# EAGLE design Master (EAGLE 9.1.3)
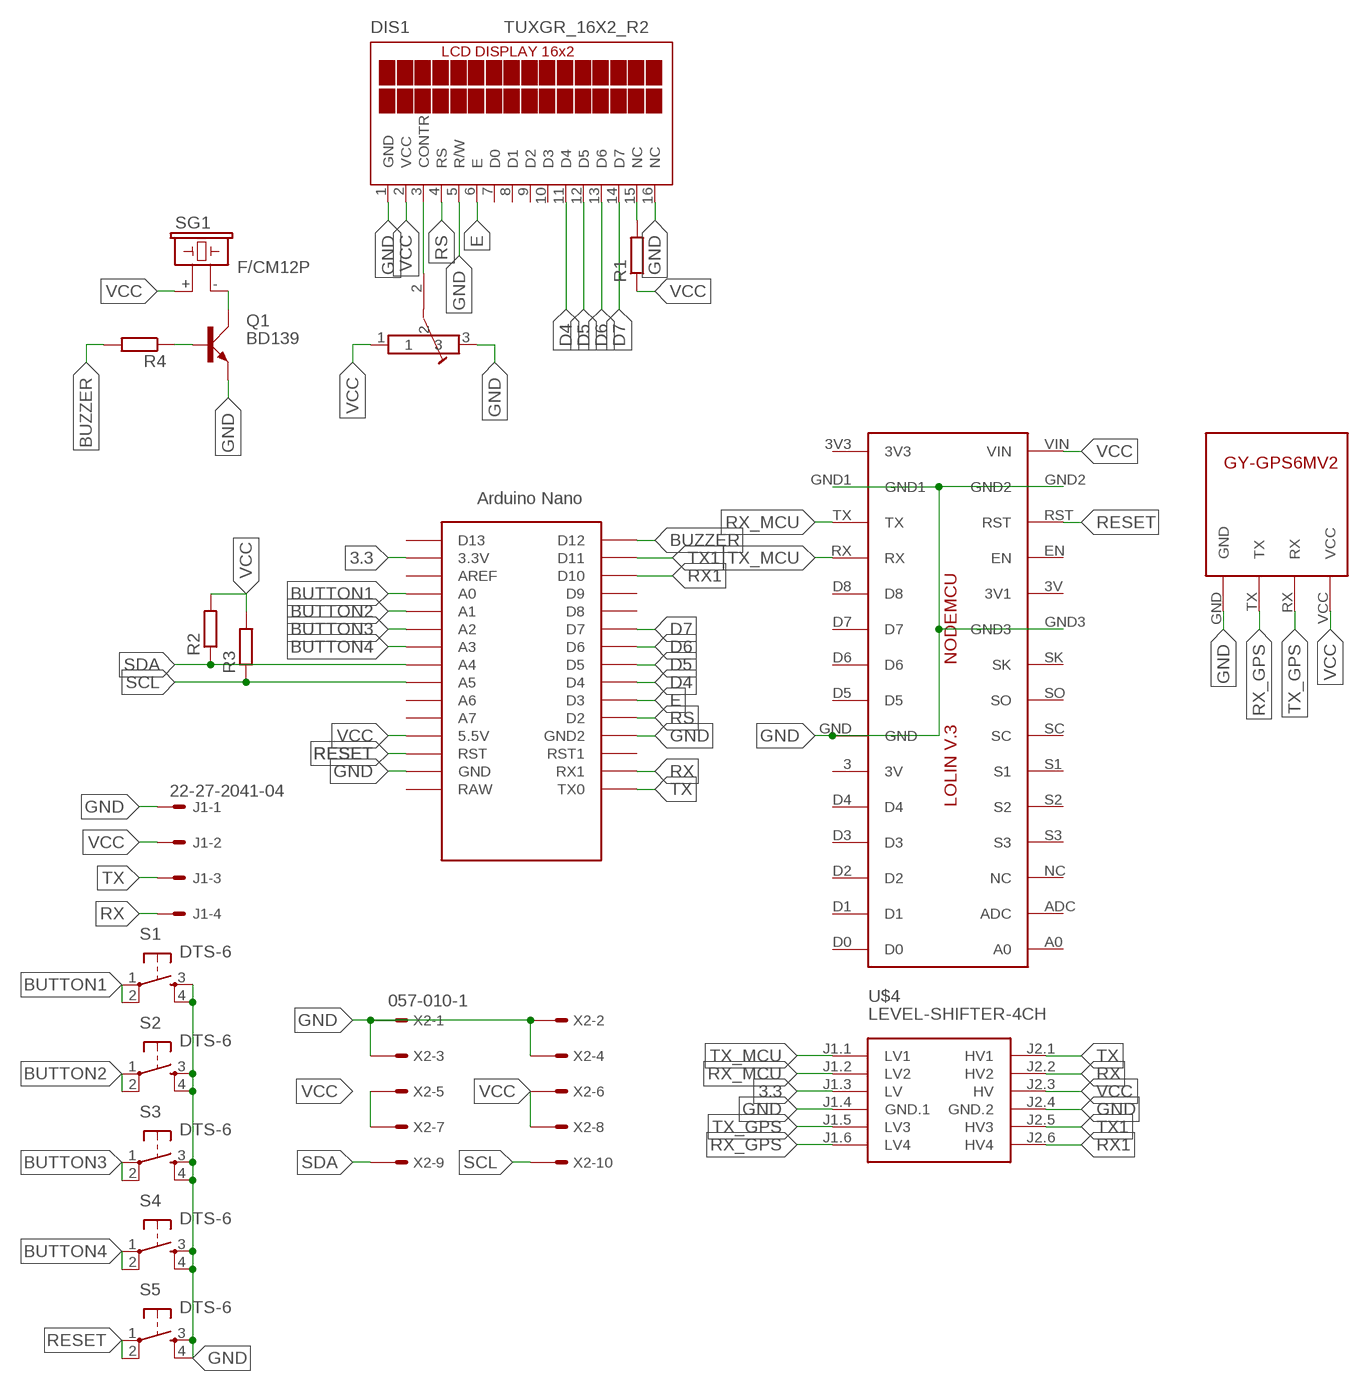
[diagram p0: schematic, sheet 1]

## Parts
DIS1  TUXGR_16X2_R2  [TUXGR_16X2_R2]
IC1  LOLINV3  [LOLINV3]
J1  22-27-2041-04  [6410-04]
Q1  BD139  [TO126AV]
R1  R-EU_M0805  [M0805]
R2  R-EU_M0805  [M0805]
R3  R-EU_M0805  [M0805]
R4  R-EU_M0805  [M0805]
S1  DTS-6  [DTS-6]
S2  DTS-6  [DTS-6]
S3  DTS-6  [DTS-6]
S4  DTS-6  [DTS-6]
S5  DTS-6  [DTS-6]
SG1  F/CM12P  [F/CM12P]
U$1  NANO  [NANO]
U$2  TRIMPOT  [TRIMPOT]
U$4  LEVEL-SHIFTER-4CH  [LEVEL-SHIFTER-4CH]
U$5  GY-GPS6MV2  [GY-GPS6MV2]
X2  057-010-1  [057-010-1]

## Nets
3.3: U$1.3.3V U$4.J1.3(LV)
BUTTON1: S1.1 S1.2 U$1.A0
BUTTON2: S2.1 S2.2 U$1.A1
BUTTON3: S3.1 S3.2 U$1.A2
BUTTON4: S4.1 S4.2 U$1.A3
BUZZER: R4.2 U$1.D12
D4: DIS1.11(D4) U$1.D4
D5: DIS1.12(D5) U$1.D5
D6: DIS1.13(D6) U$1.D6
D7: DIS1.14(D7) U$1.D7
E: DIS1.6(E) U$1.D3
GND: DIS1.1(GND) DIS1.5(R/W) DIS1.16(NC) IC1.GND IC1.GND1 IC1.GND2 IC1.GND3 J1.1 Q1.E S1.3 S1.4 S2.3 S2.4 S3.3 S3.4 S4.3 S4.4 S5.3 S5.4 U$1.GND U$1.GND1(GND2) U$2.3 U$4.J1.4(GND.1) U$4.J2.4(GND.2) U$5.GND X2.1 X2.2 X2.3 X2.4
N$1: DIS1.3(CONTR) U$2.2
N$2: DIS1.15(NC) R1.2
N$3: Q1.B R4.1
N$4: Q1.C SG1.-
RESET: IC1.RST S5.1 S5.2 U$1.RST
RS: DIS1.4(RS) U$1.D2
RX: J1.4 U$1.RX1 U$4.J2.2(HV2)
RX1: U$1.D10 U$4.J2.6(HV4)
RX_GPS: U$4.J1.6(LV4) U$5.TX
RX_MCU: IC1.TX U$4.J1.2(LV2)
SCL: R3.1 U$1.A5 X2.10
SDA: R2.1 U$1.A4 X2.9
TX: J1.3 U$1.TX0 U$4.J2.1(HV1)
TX1: U$1.D11 U$4.J2.5(HV3)
TX_GPS: U$4.J1.5(LV3) U$5.RX
TX_MCU: IC1.RX U$4.J1.1(LV1)
VCC: DIS1.2(VCC) IC1.VIN J1.2 R1.1 R2.2 R3.2 SG1.+ U$1.5V(5.5V) U$2.1 U$4.J2.3(HV) U$5.VCC X2.5 X2.6 X2.7 X2.8
Unconnected: DIS1.7(D0) DIS1.8(D1) DIS1.9(D2) DIS1.10(D3) IC1.3(3V) IC1.3V3 IC1.3V(3V1) IC1.A0 IC1.ADC IC1.D0 IC1.D1 IC1.D2 IC1.D3 IC1.D4 IC1.D5 IC1.D6 IC1.D7 IC1.D8 IC1.EN IC1.NC IC1.S1 IC1.S2 IC1.S3 IC1.SC IC1.SK IC1.SO U$1.A6 U$1.A7 U$1.AREF U$1.D8 U$1.D9 U$1.D13 U$1.RAW U$1.RST1

## Library data of the parts
DIS1 = display-lcd:TUXGR_16X2_R2: Tuxgraphics LCD display 16x2 characters reflective, without background light Source: tuxgr_12x2_r2.pdf; OC_FARNELL: unknown; OC_NEWARK: unknown
IC1 = NodeMCU Extra Memory:LOLINV3
J1 = con-molex:22-?-04: CONNECTOR wire to board 2.54 mm (.1 inch) pitch header; MF: MOLEX; OC_FARNELL: unknown; OC_NEWARK: unknown
Q1 = transistor-power:BD139: NPN TRANSISTOR
R1-R4 = rcl:R-EU_: RESISTOR, European symbol; SPICEPREFIX: R
S1-S5 = switch-tact:DTS-6
SG1 = buzzer:F/CM12P: BUZZER Source: Buerklin; OC_FARNELL: unknown; OC_NEWARK: unknown
U$1 = Arduino-clone:NANO: Arduino Nano
U$2 = trimpot:TRIMPOT
U$4 = GPS neo6mv2:LEVEL-SHIFTER-4CH: 4-Channel Bi-Directional Logic Level Converter based on BSS128 transistors Click here to find device on ebay.com <http://www.ebay.com/sch/i2c+logic+converter+module>
U$5 = GY-GPS6MV2:GY-GPS6MV2
X2 = con-panduit:057-010-: CONNECTOR 10-pin series 057 contact pc board low profile headers; OC_FARNELL: unknown; OC_NEWARK: unknown

## Board
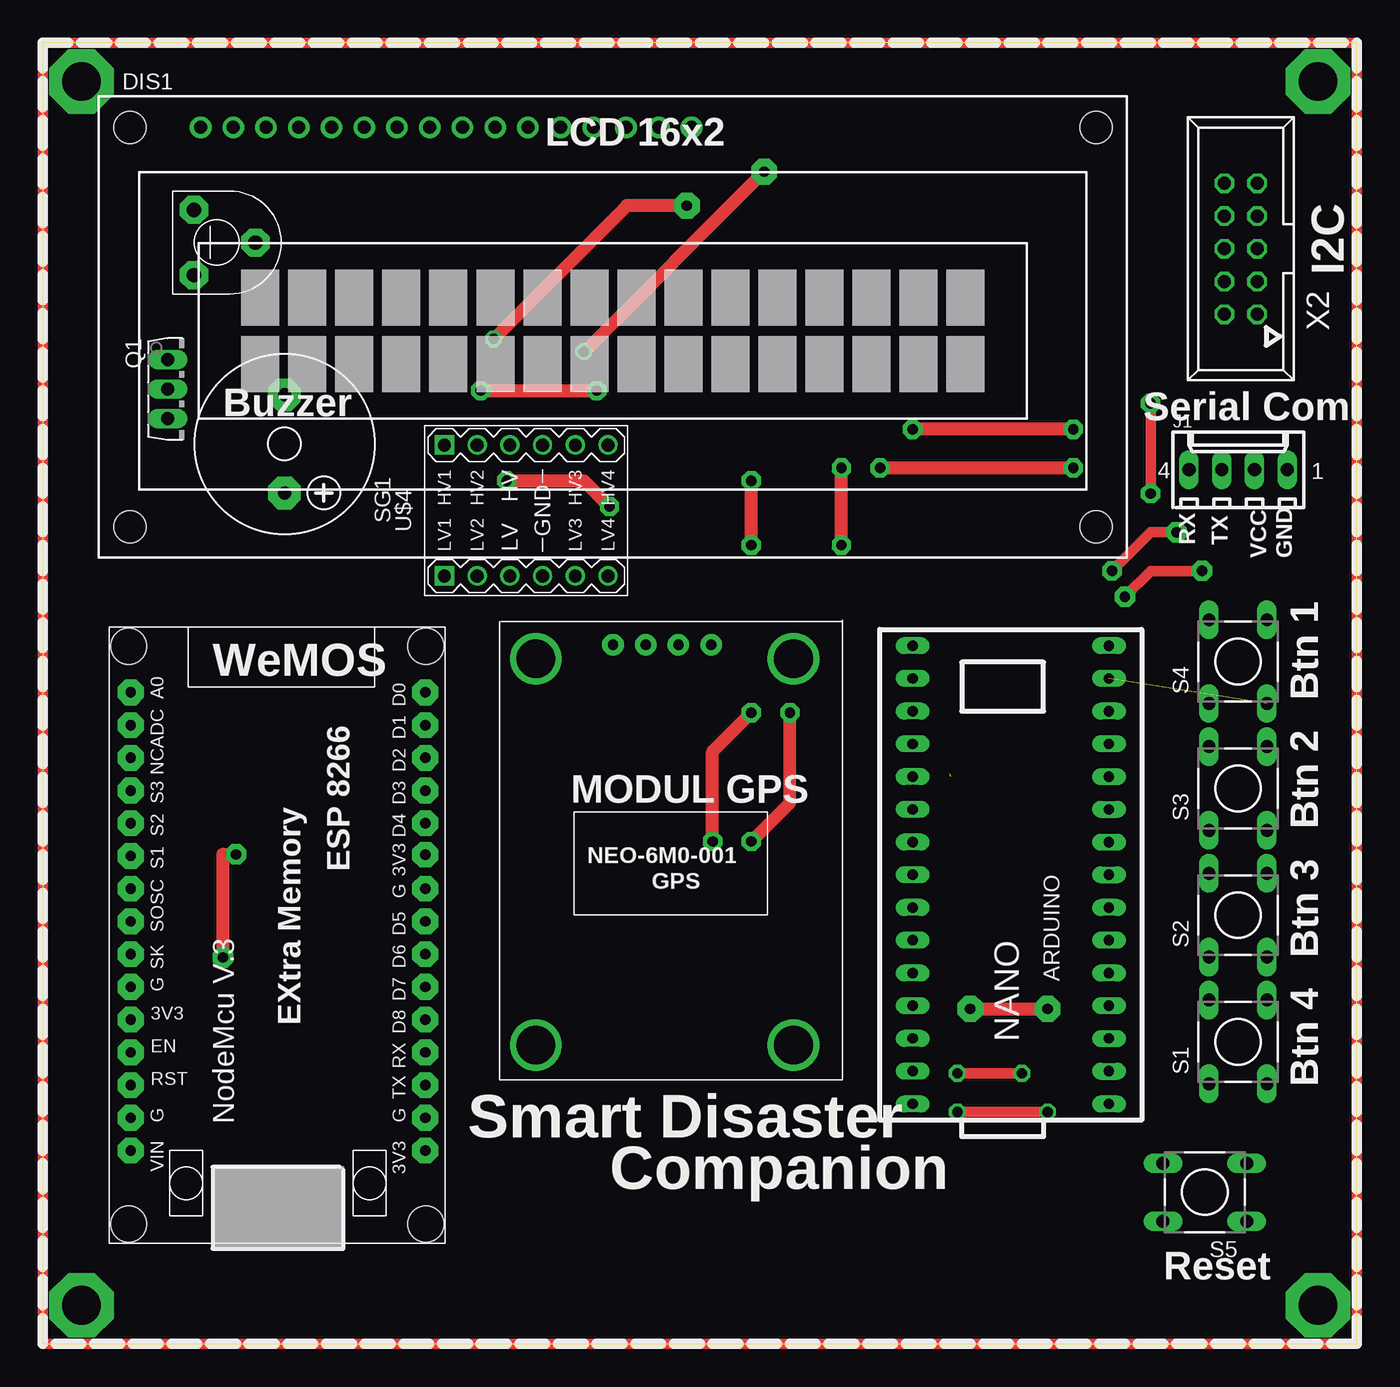
[diagram p1: board, top side]
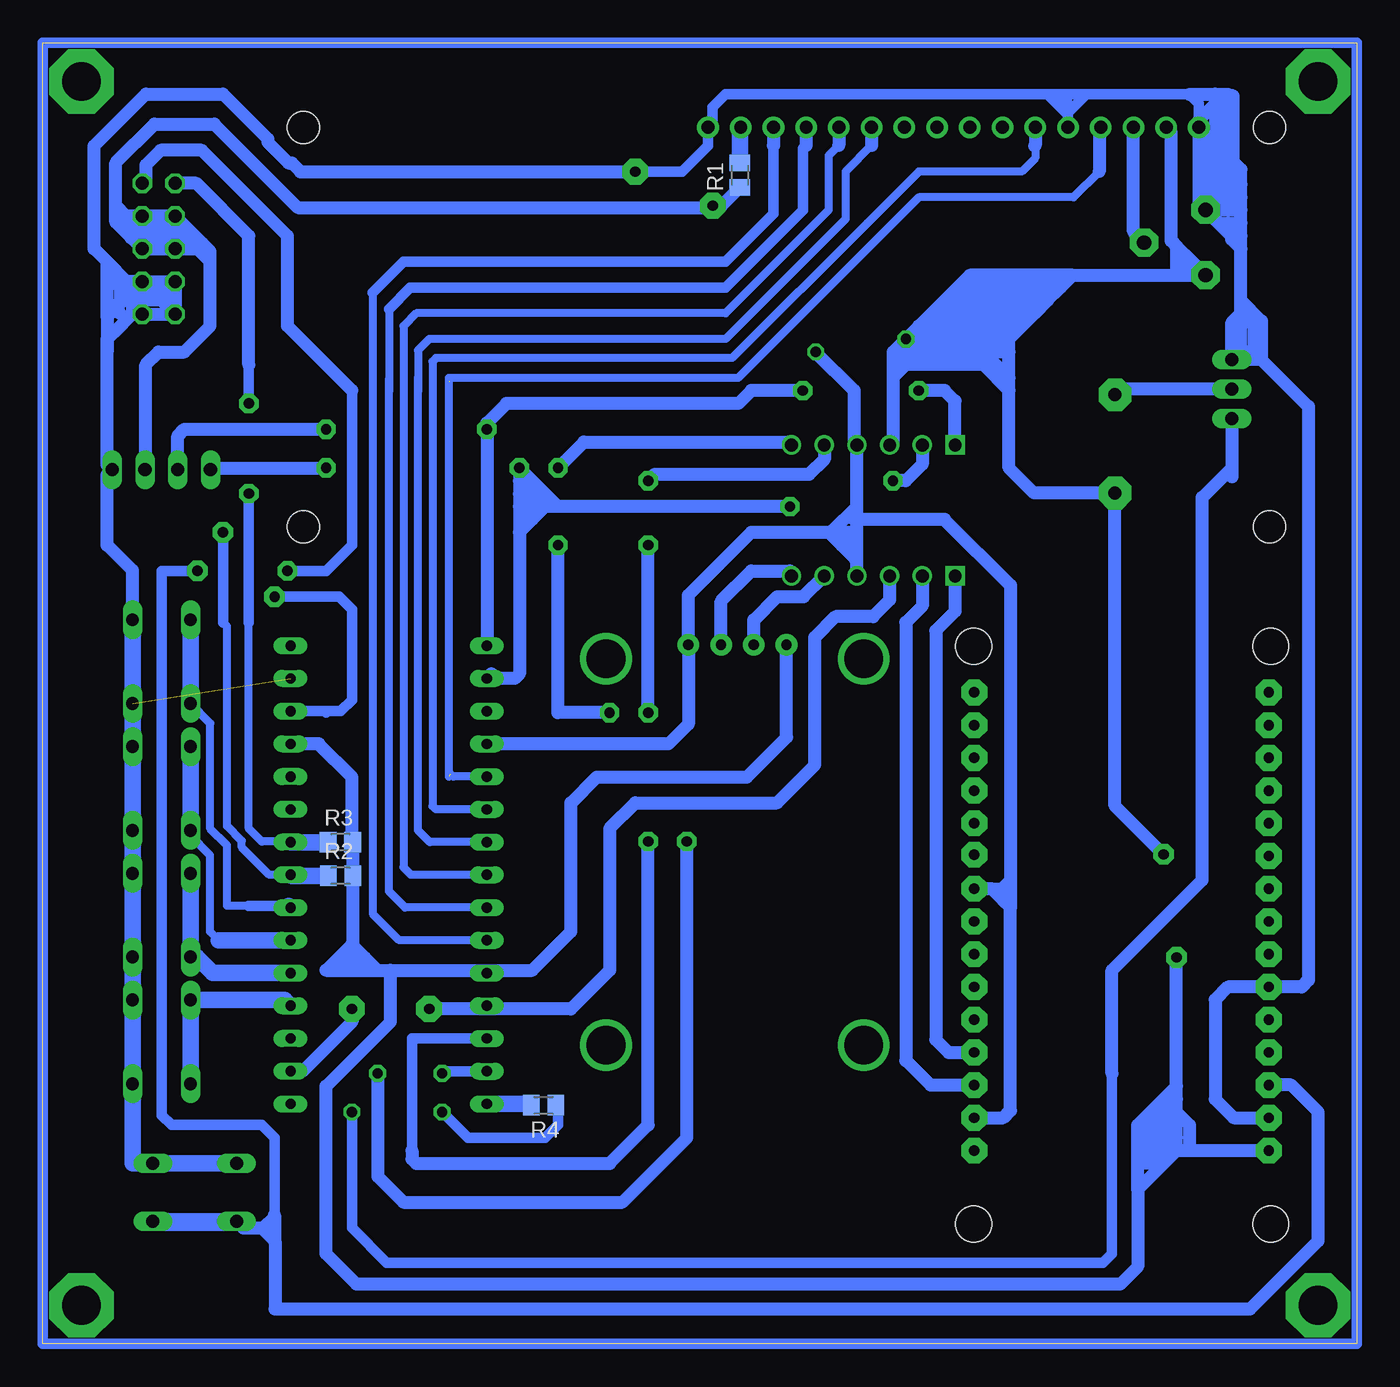
[diagram p2: board, bottom side, seen from below]

Size 102 x 101 mm. Coordinates in mm from the lower left corner, seen from the top.
Outline: 0,0 102,0 102,101 0,101 0,0
Copper layers (1*16): Top 0.035mm / dielectric 1.5mm / Bottom 0.035mm
Design rules "default": minimum track width 6mil, minimum drill 0.35mm, track to track 6mil, track to pad 6mil, pad to pad 6mil, via to via 6mil, smd to smd 6mil, copper to edge 40mil, drill to drill 6mil, minimum pad ring 10mil, minimum via ring 8mil, stop-mask expansion 4mil, vias tented up to drill 0mil, thermal gap 10mil

### Footprints (pad centres in the part's own frame; a part is rotated, then mirrored left to right if it is on the bottom)
TUXGR_16X2_R2 = drill 1 pad 1.676: 1 -32,15.5; 2 -29.46,15.5; 3 -26.92,15.5; 4 -24.38,15.5; 5 -21.84,15.5; 6 -19.3,15.5; 7 -16.76,15.5; 8 -14.22,15.5; 9 -11.68,15.5; 10 -9.14,15.5; 11 -6.6,15.5; 12 -4.06,15.5; 13 -1.52,15.5; 14 1.02,15.5; 15 3.56,15.5; 16 6.1,15.5 | hole 2.5: -37.5,-15.5; 37.5,-15.5; -37.5,15.5; 37.5,15.5
LOLINV3 = drill 0.8 pad 2 octagon: 3 -5.18,11.43; 3V 17.78,11.43; 3V3 7.62,-11.43; A0 -17.78,-11.43; ADC -15.24,-11.43; D0 -17.78,11.43; D1 -15.24,11.43; D2 -12.7,11.43; D3 -10.16,11.43; D4 -7.62,11.43; D5 0,11.43; D6 2.54,11.43; D7 5.08,11.43; D8 7.62,11.43; EN 10.16,-11.43; GND -2.54,11.43; GND1 15.24,11.43; GND2 15.24,-11.43; GND3 5.08,-11.43; NC -12.7,-11.43; RST 12.7,-11.43; RX 10.16,11.43; S1 -5.08,-11.43; S2 -7.62,-11.43; S3 -10.16,-11.43; SC -2.54,-11.43; SK 2.54,-11.43; SO 0,-11.43; TX 12.7,11.43; VIN 17.78,-11.43 | hole 2.8: 23.48,11.49; 23.48,-11.581; -21.36,-11.581; -21.36,11.49
6410-04 = drill 1.016 long: 1 3.81,0; 2 1.27,0; 3 -1.27,0; 4 -3.81,0
TO126AV = drill 1.016 long: B 2.286,-1.27; C 0,-1.27; E -2.286,-1.27
M0805 = smd 1.3 x 1.6: 1 -0.95,0; 2 0.95,0
DTS-6 = drill 1 long: 1 -3.25,2.25; 2 3.25,2.25; 3 -3.25,-2.25; 4 3.25,-2.25
F/CM12P = drill 1.016 pad 2.54 octagon: + 3.81,0; - -3.81,0
NANO = drill 0.8 long: 3.3V -7.62,13.97; 5V -7.62,-11.43; A0 -7.62,8.89; A1 -7.62,6.35; A2 -7.62,3.81; A3 -7.62,1.27; A4 -7.62,-1.27; A5 -7.62,-3.81; A6 -7.62,-6.35; A7 -7.62,-8.89; AREF -7.62,11.43; D2 7.62,-8.89; D3 7.62,-6.35; D4 7.62,-3.81; D5 7.62,-1.27; D6 7.62,1.27; D7 7.62,3.81; D8 7.62,6.35; D9 7.62,8.89; D10 7.62,11.43; D11 7.62,13.97; D12 7.62,16.51; D13 -7.62,16.51; GND -7.62,-16.51; GND1 7.62,-11.43; RAW -7.62,-19.05; RST -7.62,-13.97; RST1 7.62,-13.97; RX1 7.62,-16.51; TX0 7.62,-19.05
TRIMPOT = drill 1.1 pad 2.184 octagon: 1 -2.538,1.271; 2 0,-3.5; 3 2.536,1.271
LEVEL-SHIFTER-4CH = drill 1 square: J1.1 -5.08,6.35; J2.1 5.08,6.35 | drill 1: J1.2 -5.08,3.81; J1.3 -5.08,1.27; J1.4 -5.08,-1.27; J1.5 -5.08,-3.81; J1.6 -5.08,-6.35; J2.2 5.08,3.81; J2.3 5.08,1.27; J2.4 5.08,-1.27; J2.5 5.08,-3.81; J2.6 5.08,-6.35
GY-GPS6MV2 = drill 0.8 pad 1.676: GND 2.626,13.987; RX -2.454,13.987; TX 0.086,13.987; VCC -4.994,13.987 | drill 3: P$1 -10.985,12.898; P$2 9.015,12.898; P$3 -10.985,-17.102; P$4 9.015,-17.102
057-010-1 = drill 1 octagon: 1 -5.08,-1.27; 2 -5.08,1.27; 3 -2.54,-1.27; 4 -2.54,1.27; 5 0,-1.27; 6 0,1.27; 7 2.54,-1.27; 8 2.54,1.27; 9 5.08,-1.27; 10 5.08,1.27

### Placement (x,y rotation side)
DIS1  44.26,78.93 0 top
IC1  18.26,32.79 270 top
J1  92.79,67.85 0 top
Q1  10.97,74.12 270 top
R1  47.89,90.72 90 bottom
R2  78.88,36.34 0 bottom
R3  78.89,38.94 0 bottom
R4  63.13,18.53 180 bottom
S1  92.78,23.44 90 top
S2  92.78,33.28 90 top
S3  92.78,43.12 90 top
S4  92.78,52.96 90 top
S5  90.2,11.78 180 top
SG1  18.77,69.86 270 top
U$1  75.14,35.14 180 top
U$2  13.01,85.49 90 top
U$4  37.53,64.69 90 top
U$5  49.26,40.29 0 top
X2  93,85 90 top

### Tracks (layer width: path | path; a pad name or v marks a point on that pad's centre or on a via)
3.3  (via drill 0.8 pad 2)
  Top 1.016: v72,26 v78,26
  Bottom 1.016: U$4.J1.3 36.26,57.74 37.55,56.45 40.45,56.45 42.06,54.84 42.06,44.94 45,42 56,42 58,40 58,29 61,26 v72,26 | v78,26 78,25 81.83,21.17 U$1.3.3V
BUTTON1
  Bottom 1.27: S1.1 S1.2 83.2,26.69 U$1.A0
BUTTON2
  Bottom 1.27: S2.2 S2.1 90.03,30.03 88.79,28.79 U$1.A1
BUTTON3
  Bottom 0.61: 88.33,31.33 89,32 89,37.93 90.53,39.46
  Bottom 1.27: S3.2 S3.1 90.53,39.46 | U$1.A2 88.33,31.33
BUTTON4
  Bottom 0.61: S4.1 88.99,48.17 88.99,39.99 87.69,38.69 87.69,34 86,34
  Bottom 0.813: U$1.A3 82.89,34 86,34
  Bottom 1.27: S4.2 S4.1 | U$1.A3 82.89,34
BUZZER
  Bottom 1.27: R4.2 64.18,18.63 U$1.D12
D4
  Bottom 0.61: U$1.D4 71.95,38.95 72.87,39.87 72.87,73.87 | 72.87,73.87 72.87,75 | 37.66,93.03 39.69,91 39.69,87.31 49,78 72,78 72.87,77.13 72.87,73.87
  Bottom 1.016: DIS1.11 37.66,93.03
D5
  Bottom 0.61: U$1.D5 73.41,36.41 74,37 74,79 73,80 49,80 41,88 41,92.23 40.2,93.03
  Bottom 1.016: DIS1.12 40.2,93.03 | 40.2,93.03 | 40.2,93.03
D6
  Bottom 0.61: U$1.D6 73.87,33.87 75.13,35.13 75.13,73.87 | 75.13,73.87 75.13,74.87 | 75.13,80.34 75.13,73.87
  Bottom 0.813: 42.74,93.03 43,92.77 43,88 49,82 73.46,82 75.13,80.34
  Bottom 1.016: DIS1.13 42.74,93.03
D7
  Bottom 0.61: U$1.D7 74.33,31.33 76.39,33.39 76.39,81.61
  Bottom 0.813: 45.28,93.03 45.28,87.72 49,84 74,84 76.39,81.61
  Bottom 1.016: DIS1.14 45.28,93.03 | 45.28,93.03 | 45.28,93.03
E
  Bottom 0.61: U$1.D3 71.49,41.49 71.75,41.75 71.75,76.25 71.48,76.52 48.48,76.52 38,87 34,91 26,91 24.96,92.04 24.96,93.04
  Bottom 1.016: DIS1.6 24.96,93.04 25,93
GND  (via drill 0.8 pad 1.3, 0.8 pad 2)  (1 unrouted)
  Top 1.016: v42,77 55.98,90.98 v56,90.98
  Bottom 0.813: 24,97 49,97 50,96 50,94.79 DIS1.16 50.36,92.99 52.37,90.98 v56,90.98 | 22.5,95.5 22.42,95.42 DIS1.5 22.42,95.58 21,97 | 22.5,95.5 24,97 | DIS1.1 12.26,95 12.26,96.26 12.96,96.96 13,97 21,97 | 21,97 23,97 | 23,97 24,97 | 22.5,95.5 22.5,96.5 23,97
  Bottom 1.016: 9.97,92.14 10.91,93.08 | 10.91,93.08 DIS1.1 | 9.97,92.14 9.97,93 | 9.97,93 9.97,96.96 11,96.96 | 11,96.96 12.96,96.96 | 11,93.17 10.91,93.08 | 11,96.87 11,97 11,96.96 | 12.26,95 11,96.26 11,96.96 | 10.97,93.03 10.91,93.08 | 9,80 9.7,79.3 Q1.E 7.41,76.41 | 9,80 9,81 | 9,81 9,85 | 9,85 9,86 | 9,86 9,87 | 9,87 9,88 | 9,88 9,89 | 9,89 9,90 | 9,90 9,91.17 | 9,91.17 9.97,92.14 | U$2.3 9.03,88.03 9,88 | U$4.J1.4 38.8,61 | 38.8,61 38.8,62 | 38.8,62 38.8,63 | 38.8,63 38.8,64 | 38.8,64 38.8,65 | 38.8,65 U$4.J2.4 39,69.97 39,74 v42,77 | 7.41,76.41 3.75,72.75 3.75,28.25 4.29,27.71 IC1.GND3 10,27.71 11,26.71 11,19 9.55,17.55 IC1.GND2 | 9,81 7.41,79.41 7.41,76.41 | 9,80 8,79 8,77 9,77 9,79 | U$1.GND1 53.43,46.57 51.89,48.11 U$5.GND 51.89,58.11 47,63 41,63 | S4.4 95.03,60.03 97,62 97,67.45 J1.1 97,68.25 97,77 | 41,63 38.8,63 | 38.8,65 40.8,63 41,63 | 38.8,62 40,62 41,63 | 41,63 39,61 38.8,61 | U$2.3 11.38,88.38 | 11.38,88.38 10.77,89 | 10.77,89 9.77,90 | 9.77,90 9,90 | U$2.3 9.71,86 | 9.71,86 9,86 | U$2.3 10.71,87 10,87 9,87 | U$2.3 11.38,88.38 | 11.38,88.38 10.77,89 | 10.77,89 9,89 | 9.77,90 9.77,90.41 9.59,90.58 | 9.71,86 9.71,85.71 9,85 | IC1.GND1 27.45,17.55 26.87,18.13 26.87,34 27.37,34.5 27.5,34.5 | 28.33,35.33 IC1.GND | 27.5,34.5 28.33,35.33 | 26.87,36 26.87,33.87 27.5,34.5 | 26.87,36 26.87,58.87 32,64 38.8,64 | 38.8,64 39,64 38.8,64 | 28.33,35.33 27.54,35.33 26.87,36 | 9.59,90.58 9.59,96.87 11,96.87 | DIS1.1 12.26,88.55 U$2.3 | DIS1.1 11.38,93.55 11.38,88.38 | 11,93.17 10.77,92.94 10.77,89 | 9.97,93 9.97,89.79 10.77,89 | 9.59,90.58 9,91.17 | 11,96.87 11,93.17 | 97,77 97,78 96.5,78.5 | 96.5,78.5 95.08,79.92 X2.1 | X2.1 94.27,81 | 94.27,81 X2.3 | X2.3 X2.4 91.73,82 | 91.73,82 91.73,81
  Bottom 1.016: 91.73,81 X2.2 | 91.73,81 94.27,81 | X2.3 93.81,82 91.73,82 | X2.2 92.81,81 94.27,81 | X2.1 X2.2 | X2.3 95.86,80.86 | 95.86,80.86 96.36,80.36 | 96.36,80.36 97,79.73 | 97,79.73 97,77 | 96.5,78.5 95,80 95,81 | 96.36,80.36 96,80 | 97,79.73 97,82 | 97,82 97,84 | 97,84 98,85 98,93 94,97 88,97 84.53,93.53 84.53,93.28 82.91,91.66 82.66,91.66 81.98,90.98 v56,90.98 | X2.3 95,82.46 | 95,82.46 96,82.46 | 96,82.46 96.54,82.46 97,82 | 96,82.46 96,81 95.86,80.86 | 97,84 95.46,82.46 95,82.46
  Bottom 1.27: S4.4 S4.3 S3.4 S3.3 S2.4 S2.3 S1.4 S1.3 95.03,14.03 S5.3 S5.4
N$1
  Bottom 1.016: U$2.2 16.51,85.51 17.34,86.34 DIS1.3
N$2
  Bottom 1.27: R1.2 47.89,94.36 DIS1.15
N$3  (via drill 0.8 pad 1.3)
  Top 0.813: v78,18 v71,18
  Bottom 0.813: 19,21 19,7 19.71,6.29 75.29,6.29 78,9 v78,18 | R4.1 62,18.35 62,17 63,16 69,16 v71,18
  Bottom 1.016: Q1.B 9.7,68 | 9.7,68 9.7,67.3 | 19,21 19,29 12,36 12,65.7 9.7,68
N$4
  Bottom 1.016: Q1.C 18.32,74.12 SG1.-
N$5
  Bottom 0.813: 0,101 102,101 102,0 0,0 0,101
N$6
  Top 0.813: 0,101 102,101 102,0 0,0 0,101
N$7  (via drill 3 pad 5)
  other vias: 99,98
N$8  (via drill 3 pad 5)
  other vias: 3,98
N$9  (via drill 3 pad 5)
  other vias: 3,3
N$10  (via drill 3 pad 5)
  other vias: 99,3
RESET  (via drill 0.8 pad 1.6)
  Top 0.813: v84,58 86,60 v90,60
  Bottom 0.813: U$1.RST 80.11,49.11 | 80.11,49.11 80,49 | 80.11,49.11 | 80.11,49.11 78.89,49.11 78,50 78,57 79,58 v84,58 | v90,60 92.75,60 92.75,17.75 92,17 85,17 84,16 84,10 85,9 86.42,9 86.71,9.29 S5.2
  Bottom 1.016: S5.1 93.21,9.29 86.71,9.29 | S5.2 86.42,9 85,9 84,8 | IC1.RST 5.09,20.09 3,18 3,8 8.29,2.71 83.97,2.71 83.97,7.97 84,8 | 84,10 84,8
  Bottom 1.27: S5.1 S5.2
RS  (2 unrouted)
  Bottom 0.61: 70.36,44.25 70.14,44.03 U$1.D2 | 70.46,74.72 70.46,74.97 48.03,74.97 34,89 22,89 20,91 | 70.49,74.62 70.46,74.65 70.46,44.03
  Bottom 1.016: DIS1.4 20,94.31 20,91
RX  (via drill 0.8 pad 1.5)
  Top 1.016: v36,67 42,67 v44,65 | v80,68 v65,68
  Bottom 1.016: 67.17,52 U$1.RX1 65.35,51.65 65,52 65,63 | U$4.J2.2 33.72,68.28 35,67 v36,67 | 62,65 63,65 | 63,65 64,64 | 64,64 65,63 | J1.4 88.83,68 v80,68 | v65,68 62,65 | v44,65 62,65 | v65,68 65,66 | 65,66 65,65 | 65,65 65,63 | v65,68 65,67 63,65 | 65,66 64,65 63,65 | 65,65 64,64
RX1  (via drill 0.8 pad 1.5)
  Top 1.016: v55,39 58,42 v58,49 | v62,62 v62,68
  Bottom 0.813: U$1.D10 73.34,23.71 73.34,15 73.34,14.5
  Bottom 1.016: 73.34,15 73.34,14.34 73,14 58,14 55,17 v55,39 | v58,49 62,49 v62,62 | v62,68 60,70 44.11,70 U$4.J2.6
RX_GPS
  Bottom 1.016: U$5.TX 49.35,57.65 47,60 44,60 43.88,59.88 U$4.J1.6
RX_MCU
  Bottom 1.016: U$4.J1.2 33.72,57.28 35,56 35,22 33.09,20.09 IC1.TX
SCL  (via drill 0.8 pad 1.5)
  Top 0.813: v86,66 v86,73
  Bottom 0.61: U$1.A5 82.81,39 85,39 86,40 86,56
  Bottom 0.813: 86,56 v86,66 | v86,73 86,76
  Bottom 1.016: 86,76 86,86 90.08,90.08 X2.10
  Bottom 1.27: R3.1 82.75,38.94 U$1.A5
SDA  (via drill 0.8 pad 1.5, 0.8 pad 1.6)
  Top 0.813: v83,60 86,63 v88,63
  Bottom 0.61: U$1.A4 84.41,36.41 86.55,38.55 86.55,39.05 87.69,40.2 87.69,55.69 88,56
  Bottom 0.813: 88,56 v88,63 | v83,60 80,60 79,61 78,62 78,74 | 78,74
  Bottom 1.016: 78,74 83,79 83,86 89.65,92.65 92.85,92.65 94,91.49 94,90.35 X2.9
  Bottom 1.27: R2.1 82.69,36.34 U$1.A4
TX  (via drill 0.8 pad 1.5)
  Top 1.016: v34,74 v43,74 | v80,71 v67.52,71
  Bottom 1.016: U$4.J2.1 31.18,73.18 32,74 v34,74 | v43,74 47,74 48,73 66,73 67.52,71.48 v67.52,71 U$1.TX0 | J1.3 91.52,70.48 91,71 v80,71
TX1  (via drill 0.8 pad 1.3, 0.8 pad 1.5)
  Top 0.813: v76,21 v71,21
  Top 1.016: v52,39 52,46 v55,49 | v55,62 v55,67
  Bottom 0.813: v71,21 70.83,21.17 U$1.D11
  Bottom 1.016: U$4.J2.5 41.34,68.66 42.5,67.5 54.5,67.5 v55,67 | v52,39 52,16 57,11 74,11 76,13 v76,21 | v55,49 v55,62
TX_GPS
  Bottom 1.016: U$5.RX 46.81,56.19 45,58 42.95,58 U$4.J1.5
TX_MCU
  Bottom 1.016: U$4.J1.1 31.18,56.85 32.67,55.36 32.67,23.61 31.69,22.63 IC1.RX
VCC  (via drill 0.8 pad 1.3, 0.8 pad 1.6, 0.8 pad 2)
  Top 1.016: v14,30 14,38 v15,38 | v50,88.35 45.35,88.35 v35,78
  Bottom 1.016: 77.93,38.93 R3.2 | R3.2 78,39 78,44 80.57,46.57 U$1.5V | 12.89,84.11 U$2.1 14,82.95 | 12.89,84.11 13.89,85.11 | 13.89,85.11 14.41,85.63 14.41,94.05 DIS1.2 | 27,74 27,68 25.05,66.05 SG1.+ 18.77,41.77 v15,38 | 27,74 29,76 35,76 36,75 36,74 | U$4.J2.3 36,70.03 36,74 | 27,74 27,75 | 27,75 27,77 | 27,77 27,78 | 22.05,82.95 14,82.95 | 27,78 26,79 | 26,79 25,80 | 25,80 24,81 | 24,81 23,82 | 23,82 22.05,82.95 | 27,78 33,78 | 33,78 v35,78 | v35,78 36,77 | 36,77 36,76 | 36,76 36,74 | 27,77 29,77 | 29,77 35,77 36,76 | 29,77 27,75 | 22.05,82.95 30.05,82.95 34,79 | 34,79 v35,78 | v35,78 36,77 | 23,82 30,82 33,79 34,79 | 24,81 30,81 32,79 | 32,79 33,78 | 25,80 30,80 31,79 | 31,79 32,79 | 26,79 31,79 | 13.89,85.11 14,85 14,83 | 14,83 14,82.95 | 12.89,84.11 14,83 | R3.2 77.94,36.06 78,36 77.93,36.07 R2.2 77.93,30.93 | 77.93,30.93 77,30 | 77,30 76,29 | 76,29 75,29 | 75,29 64,29 61,32 61,42 59,44 47.34,44 44.26,47.09 U$5.VCC | R1.1 49.3,88.35 v50,88.35 50.15,88.2 82.2,88.2 88.68,94.68 93.32,94.68 96.33,91.67 96.33,88.33 | IC1.VIN 13,15 | 13,15 14,15 | 14,15 17,12 | 17,12 17,6 18.36,4.63 77.64,4.63 80,7 80,20 75,25 75,29 | 77.93,30.93 78.07,30.93 80,29 79,29 | 79,29 76,29 | 77,30 78,29 79,29 | 79,29 78,30 | 14,15 14,16 | 14,16 14,17 | 14,17 14,18 | 14,18 14,19 | 14,19 14,20 | 14,20 v14,30 | 17,12 17,14 | 17,14 17,15 | 17,15 17,16 | 17,16 17,17 | 17,17 14,20 | 14,19 16,17 17,17 | 14,18 16,16 17,16 | 14,17 16,15 17,15 | 14,16 16,14 17,14 | 14,18 13,17 13,15 | J1.2 94,67.91 94,76 93,77 91,77 89,79 89,84 | 89.59,85.41 89,84.81 89,84 | 89.59,85.41 90.59,86.41 | 90.59,86.41 91.09,86.91 | 91.09,86.91 X2.8 X2.7 | X2.7 94.27,87 | 94.27,87 X2.5 | X2.5 X2.6 | X2.6 91.33,85.41 89.59,85.41 | 90.59,86.41 91,86 94,86 94,86.73 94.27,87
  Bottom 1.016: X2.7 93.64,86.91 91.09,86.91 | X2.6 90,85 89,84 | X2.7 95.54,87.54 | 95.54,87.54 96.33,88.33 | X2.5 95.14,85.86 | 95.14,85.86 96.33,87.06 96.33,88.33 | 95.54,87.54 95.14,87.14 95.14,85.86

### Text on the board
tSilk: LCD 16x2 | I2C | Buzzer | Serial Com | RX | TX | VCC | GND | Btn 1 | MODUL GPS | Btn 2 | Btn 3 | Btn 4 | Smart Disaster | Companion | Reset